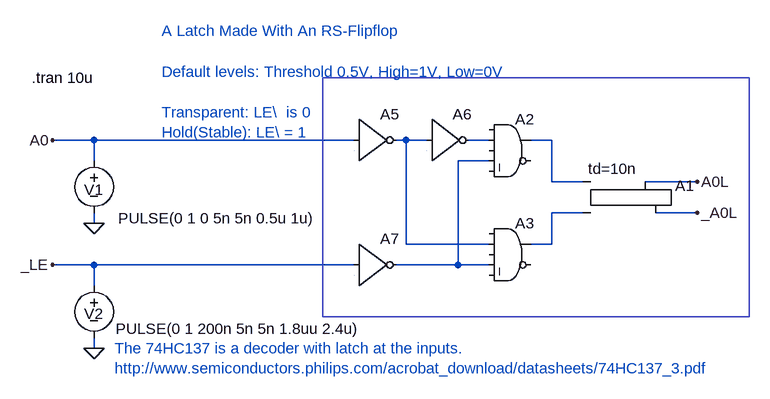
[diagram p0: schematic Latch_test.asc]
Latch_test.asc, the LTspice schematic file:
Version 4
SHEET 1 1060 680
WIRE -672 112 -736 112
WIRE -272 112 -672 112
WIRE -192 112 -208 112
WIRE -160 112 -192 112
WIRE -64 112 -96 112
WIRE 32 112 0 112
WIRE -672 144 -672 112
WIRE -64 144 -112 144
WIRE 32 176 32 112
WIRE 80 176 32 176
WIRE 256 176 176 176
WIRE 80 224 32 224
WIRE 256 224 192 224
WIRE -672 240 -672 224
WIRE -192 272 -192 112
WIRE -64 272 -192 272
WIRE 32 272 32 224
WIRE 32 272 0 272
WIRE -672 304 -736 304
WIRE -272 304 -672 304
WIRE -112 304 -112 144
WIRE -112 304 -208 304
WIRE -64 304 -112 304
WIRE -672 336 -672 304
WIRE -672 432 -672 416
FLAG -672 240 0
FLAG -672 432 0
FLAG -736 304 _LE
FLAG -736 112 A0
FLAG 256 176 A0L
FLAG 256 224 _A0L
SYMBOL Digital\\srflop 128 128 R0
WINDOW 39 -40 28 Left 0
SYMATTR SpiceLine td=10n
SYMATTR InstName A1
SYMBOL Digital\\and -32 64 R0
SYMATTR InstName A2
SYMBOL Digital\\and -32 224 R0
SYMATTR InstName A3
SYMBOL Digital\\inv -272 48 R0
SYMATTR InstName A5
SYMBOL Digital\\inv -160 48 R0
SYMATTR InstName A6
SYMBOL Digital\\inv -272 240 R0
SYMATTR InstName A7
SYMBOL voltage -672 128 R0
WINDOW 123 0 0 Left 0
WINDOW 39 0 0 Left 0
WINDOW 0 -15 60 Left 0
WINDOW 3 37 104 Left 0
SYMATTR InstName V1
SYMATTR Value PULSE(0 1 0 5n 5n 0.5u 1u)
SYMBOL voltage -672 320 R0
WINDOW 123 0 0 Left 0
WINDOW 39 0 0 Left 0
WINDOW 0 -15 59 Left 0
WINDOW 3 33 82 Left 0
SYMATTR InstName V2
SYMATTR Value PULSE(0 1 200n 5n 5n 1.8uu 2.4u)
TEXT -768 16 Left 0 !.tran 10u
TEXT -568 -56 Left 0 ;A Latch Made With An RS-Flipflop\n \nDefault levels: Threshold 0.5V, High=1V, Low=0V\n \nTransparent: LE\\  is 0\nHold(Stable): LE\\ = 1
TEXT -640 432 Left 0 ;The 74HC137 is a decoder with latch at the inputs.\nhttp://www.semiconductors.philips.com/acrobat_download/datasheets/74HC137_3.pdf
RECTANGLE Normal 336 384 -320 16

The netlist it stands for:
* Latch_test.asc
A1 N003 N005 0 0 0 _A0L A0L 0 SRFLOP td=10n
A2 0 N002 0 N004 0 0 N003 0 AND
A3 0 N001 0 N004 0 0 N005 0 AND
A5 A0 0 0 0 0 N001 0 0 BUF
A6 N001 0 0 0 0 N002 0 0 BUF
A7 _LE 0 0 0 0 N004 0 0 BUF
V1 A0 0 PULSE(0 1 0 5n 5n 0.5u 1u)
V2 _LE 0 PULSE(0 1 200n 5n 5n 1.8uu 2.4u)
.tran 10u
* A Latch Made With An RS-Flipflop
* Default levels: Threshold 0.5V, High=1V, Low=0V
* Transparent: LE\  is 0
* Hold(Stable): LE\ = 1
* The 74HC137 is a decoder with latch at the inputs.
* http://www.semiconductors.philips.com/acrobat_download/datasheets/74HC137_3.pdf
.backanno
.end